# Altium schematic sheet totem.SchDoc
size A4; SheetNumber: 2; SheetTotal: 6
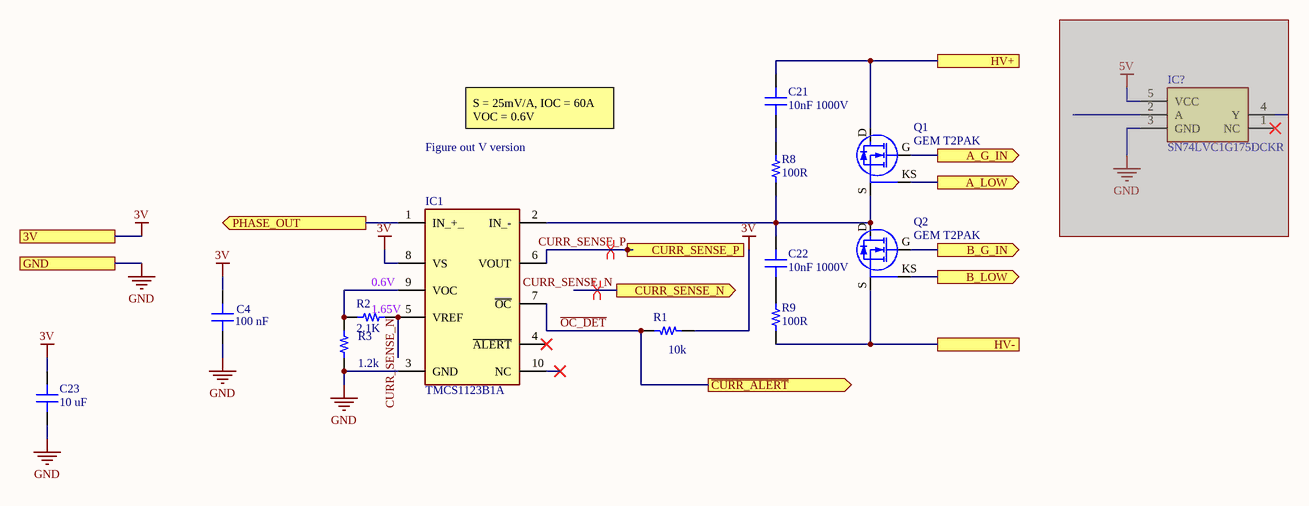
[diagram p0: totem.SchDoc]

## Parts
C4  Capacitance: 100 nF  [CAP 0603_1608]  (hidden comment: 20 pF)
C21  10nF 1000V  [CAP 1206_3216 - 0.8MM]
C22  10nF 1000V  [CAP 1206_3216 - 0.8MM]
C23  Capacitance: 10 uF  [CAP 0603_1608]  (hidden comment: 20 pF)
IC1  TMCS1123B1A  [TMCS1126A8AQDVGRQ1]
IC?  SN74LVC1G175DCKR  [SOP65P210X110-6N]  (masked out: inside a compile mask, not in the netlist)
Q1  GEM T2PAK  [GEM T2PAK H3.6]
Q2  GEM T2PAK  [GEM T2PAK H3.6]
R1  10k  [RES 0603_1608]
R2  2.1K  [RES 0603_1608]
R3  1.2k  [RES 0603_1608]
R8  100R  [RES 1206_3216]
R9  100R  [RES 1206_3216]

## Ports
3V, A_G_IN (out), A_LOW (out), B_G_IN (out), B_LOW (out), CURR_SENSE_N (out), CURR_SENSE_P (out), GND, HV+, HV-, PHASE_OUT (out), ~{CURR_ALERT} (out)

## Nets
3V: C4.1 C23.1 IC1.8(VS) R1.2 ; port 3V
GND: C4.2 C23.2 IC1.3(GND) R3.2 ; port GND
~{OC_DET}: IC1.7(~{OC}) R1.1 ; port ~{CURR_ALERT}
A_G_IN: Q1.G ; port A_G_IN
A_LOW: Q1.KS ; port A_LOW
B_G_IN: Q2.G ; port B_G_IN
B_LOW: Q2.KS ; port B_LOW
CURR_SENSE_N: IC1.5(VREF) R2.2 ; port CURR_SENSE_N
CURR_SENSE_P: IC1.6(VOUT) ; port CURR_SENSE_P
HV+: C21.2 Q1.D ; port HV+
HV-: Q2.S R9.1 ; port HV-
PHASE_OUT: IC1.1(IN_+_) ; port PHASE_OUT
NetC21_1: C21.1 R8.2
NetC22_1: C22.1 R9.2
NetC22_2: C22.2 IC1.2(IN_-) Q1.S Q2.D R8.1
NetIC1_9: IC1.9(VOC) R2.1 R3.1

Not connected (* = marked no-connect by the designer): IC1 4(~{ALERT})* 10(NC)*

## Layout directives
differential pair: CURR_SENSE_N, CURR_SENSE_P

## Notes on the sheet
- S = 25mV/A, IOC = 60A
  VOC = 0.6V
- Figure out V version
- (near R2) 1.65V
- 0.6V
- MY
- 25
- Project:
- Author
- Revision
- Sheet
- Modified
- of

## Library data of the parts
C4 C23 = C0603C200K5GAC7867: CAP CER 20PF 50V NP0 0603; manufacturer: KEMET; Temperature Coefficient: C0G, NP0; Tolerance: ±10%; Part Number: C0603C200K5GAC7867; Applications: General Purpose; componentlink1description: Datasheet; componentlink1url: https://api.kemet.com/component-edge/download/datasheet/C0603C200K5GACTU.pdf; componentlink2description: DigiKey Link; componentlink2url: https://www.digikey.com/en/products/detail/kemet/C0603C200K5GAC7867/2200149; Device Package: 0603 (1608 Metric); Features: Low ESL; lastupdated: 2/9/2024 8:10:26 PM; Lifecycle Status: Active; Minimum Order: 1; Mounting Type: Surface Mount, MLCC; Operating Temperature: -55°C ~ 125°C; Package / Case: 0603 (1608 Metric); packaging: TapeAndReel; partid: 5330; Part Status: Active; price: 0.04; series: SMD Comm C0G; Size / Dimension: 0.063" L x 0.031" W (1.60mm x 0.80mm); Supplier 1: DigiKey; Supplier Part Number 1: 399-17401-1-ND; Thickness (Max): 0.034" (0.87mm); value: 20 pF; Voltage - Rated: 50V
C21 C22 = MM062C102KCZ2A: CAP CER 1000PF 200V X7R 1206; manufacturer: AVX Corporation; Tolerance: ±10%; Part Number: MM062C102KCZ2A; Capacitance: 1000pF; Applications: Medical, Non-Critical; componentlink1description: Datasheet; componentlink1url: http://datasheets.avx.com/AVX-MM.pdf; componentlink2description: DigiKey Link; componentlink2url: http://digikey.com/product-detail/en/avx-corporation/MM062C102KCZ2A/478-10625-1-ND/7344886; Device Package: 1206 (3216 Metric); lastupdated: 9/2/2020 1:04:46 AM; Lifecycle Status: Active; Minimum Order: 1; Mounting Type: Surface Mount, MLCC; Operating Temperature: -55°C ~ 125°C; Package / Case: 1206 (3216 Metric); packaging: TapeAndReel; partid: 18686; Part Status: Active; price: 0.57; series: MM; Size / Dimension: 0.126" L x 0.063" W (3.20mm x 1.60mm); Supplier 1: DigiKey; Supplier Part Number 1: 478-10625-1-ND; Temperature Coefficient: X7R; Thickness (Max): 0.029" (0.74mm); value: 1000pF; Voltage - Rated: 200V
IC1 = TMCS1123A1AQDVGR: Integrated Circuit; Manufacturer_Name: Texas Instruments; Datasheet Link: https://www.ti.com/lit/ds/symlink/tmcs1123.pdf?ts=1707973672803&ref_url=https%253A%252F%252Fwww.google.com%252F; Height: 2.65mm; Manufacturer_Part_Number: TMCS1123A1AQDVGR; Mouser Part Number: 595-TMCS1123A1AQDVGR; Mouser Price/Stock: https://www.mouser.co.uk/ProductDetail/Texas-Instruments/TMCS1123A1AQDVGR?qs=mELouGlnn3ezMP2QpzrvaA%3D%3D; Arrow Part Number: TMCS1123A1AQDVGR; Arrow Price/Stock: https://www.arrow.com/en/products/tmcs1123a1aqdvgr/texas-instruments?region=nac
IC? = SN74LVC1G175DCKR: Integrated Circuit; Manufacturer_Name: Texas Instruments; Datasheet Link: http://www.ti.com/lit/gpn/sn74lvc1g175; Height: 1.1mm; Manufacturer_Part_Number: SN74LVC1G175DCKR; Mouser Part Number: 595-SN74LVC1G175DCKR; Mouser Price/Stock: https://www.mouser.co.uk/ProductDetail/Texas-Instruments/SN74LVC1G175DCKR?qs=pajgIaoyDUjI2BH1x6CpqQ%3D%3D; Arrow Part Number: SN74LVC1G175DCKR; Arrow Price/Stock: https://www.arrow.com/en/products/sn74lvc1g175dckr/texas-instruments?region=nac
R1 = RNCS0603BKE10K0: RES 10K OHM 0.1% 1/16W 0603; Manufacturer: Stackpole Electronics Inc; Value: 1k; Power (Watts): 0.063W, 1/16W; Resistance: 10 kOhms; Temperature Coefficient: ±25ppm/°C; Part Number: RNCS0603BKE10K0; ComponentLink1Description: Datasheet; ComponentLink1URL: https://www.seielect.com/catalog/sei-rncs_rnch.pdf; ComponentLink2Description: DigiKey Link; ComponentLink2URL: https://www.digikey.com/en/products/detail/stackpole-electronics-inc/RNCS0603BKE10K0/1708836; Composition: Thin Film; Device Package: 0603 (1608 Metric); Features: Anti-Corrosive, Automotive AEC-Q200, Moisture Resistant; Height - Seated (Max): 0.022" (0.55mm); LastUpdated: 2/9/2024 8:43:37 PM; Lifecycle Status: Active; Minimum Order: 1; Number of Terminations: 2; Operating Temperature: -55°C ~ 155°C; Package / Case: 0603 (1608 Metric); Packaging: TapeAndReel; PartId: 4838; Part Status: Active; Price: 0.06; Ratings: AEC-Q200; Series: RNCS; Size / Dimension: 0.061" L x 0.031" W (1.55mm x 0.80mm); Supplier 1: DigiKey; Supplier Part Number 1: RNCS0603BKE10K0CT-ND; Supplier Device Package: 0603; Tolerance: ±0.1%
R2 = RNCS0603BKE7K50: RES 7.5K OHM 0.1% 1/16W 0603; Manufacturer: Stackpole Electronics Inc; Power (Watts): 0.063W, 1/16W; Resistance: 7.5 kOhms; Temperature Coefficient: ±25ppm/°C; Part Number: RNCS0603BKE7K50; Value: 2.1K; ComponentLink1Description: Datasheet; ComponentLink1URL: https://www.seielect.com/catalog/sei-rncs_rnch.pdf; ComponentLink2Description: DigiKey Link; ComponentLink2URL: https://www.digikey.com/en/products/detail/stackpole-electronics-inc/RNCS0603BKE7K50/1800055; Composition: Thin Film; Device Package: 0603 (1608 Metric); Features: Anti-Corrosive, Automotive AEC-Q200, Moisture Resistant; Height - Seated (Max): 0.022" (0.55mm); LastUpdated: 2/9/2024 8:43:37 PM; Lifecycle Status: Active; Minimum Order: 1; Number of Terminations: 2; Operating Temperature: -55°C ~ 155°C; Package / Case: 0603 (1608 Metric); Packaging: TapeAndReel; PartId: 4846; Part Status: Active; Price: 0.06; Ratings: AEC-Q200; Series: RNCS; Size / Dimension: 0.061" L x 0.031" W (1.55mm x 0.80mm); Supplier 1: DigiKey; Supplier Part Number 1: RNCS0603BKE7K50CT-ND; Supplier Device Package: 0603; Tolerance: ±0.1%
R3 = RNCS0603BKE10K0: RES 10K OHM 0.1% 1/16W 0603; Manufacturer: Stackpole Electronics Inc; Power (Watts): 0.063W, 1/16W; Resistance: 10 kOhms; Temperature Coefficient: ±25ppm/°C; Part Number: RNCS0603BKE10K0; Value: 10k; ComponentLink1Description: Datasheet; ComponentLink1URL: https://www.seielect.com/catalog/sei-rncs_rnch.pdf; ComponentLink2Description: DigiKey Link; ComponentLink2URL: https://www.digikey.com/en/products/detail/stackpole-electronics-inc/RNCS0603BKE10K0/1708836; Composition: Thin Film; Device Package: 0603 (1608 Metric); Features: Anti-Corrosive, Automotive AEC-Q200, Moisture Resistant; Height - Seated (Max): 0.022" (0.55mm); LastUpdated: 2/9/2024 8:43:37 PM; Lifecycle Status: Active; Minimum Order: 1; Number of Terminations: 2; Operating Temperature: -55°C ~ 155°C; Package / Case: 0603 (1608 Metric); Packaging: TapeAndReel; PartId: 4838; Part Status: Active; Price: 0.06; Ratings: AEC-Q200; Series: RNCS; Size / Dimension: 0.061" L x 0.031" W (1.55mm x 0.80mm); Supplier 1: DigiKey; Supplier Part Number 1: RNCS0603BKE10K0CT-ND; Supplier Device Package: 0603; Tolerance: ±0.1%
R8 R9 = Y4063100R000A0R: RES SMD 100 OHM 0.05% 1/2W 1206; Manufacturer: Vishay Foil Resistors (Division of Vishay Precision Group); Power (Watts): 0.5W, 1/2W; Resistance: 100 Ohms; Temperature Coefficient: ±2.5ppm/°C; Value: 100 Ohms; Part Number: Y4063100R000A0R; ComponentLink1Description: Datasheet; ComponentLink1URL: http://www.vishaypg.com/docs/63211/FRSHZ.pdf; ComponentLink2Description: DigiKey Link; ComponentLink2URL: https://www.digikey.com/en/products/detail/vishay-foil-resistors-division-of-vishay-precision-group/Y4063100R000A0R/3046987; Composition: Metal Foil; Device Package: 1206 (3216 Metric); Features: Moisture Resistant, Non-Inductive; Height - Seated (Max): 0.025" (0.64mm); LastUpdated: 2/9/2024 8:54:29 PM; Lifecycle Status: Active; Minimum Order: 1; Number of Terminations: 2; Operating Temperature: -55°C ~ 225°C; Package / Case: 1206 (3216 Metric); Packaging: TapeAndReel; PartId: 30795; Part Status: Active; Price: 12.79; Series: FRSH; Size / Dimension: 0.126" L x 0.062" W (3.20mm x 1.57mm); Supplier 1: DigiKey; Supplier Part Number 1: Y4063-100ACT-ND; Supplier Device Package: 1206; Tolerance: ±0.05%